# Altium schematic sheet Main.SchDoc
size A4
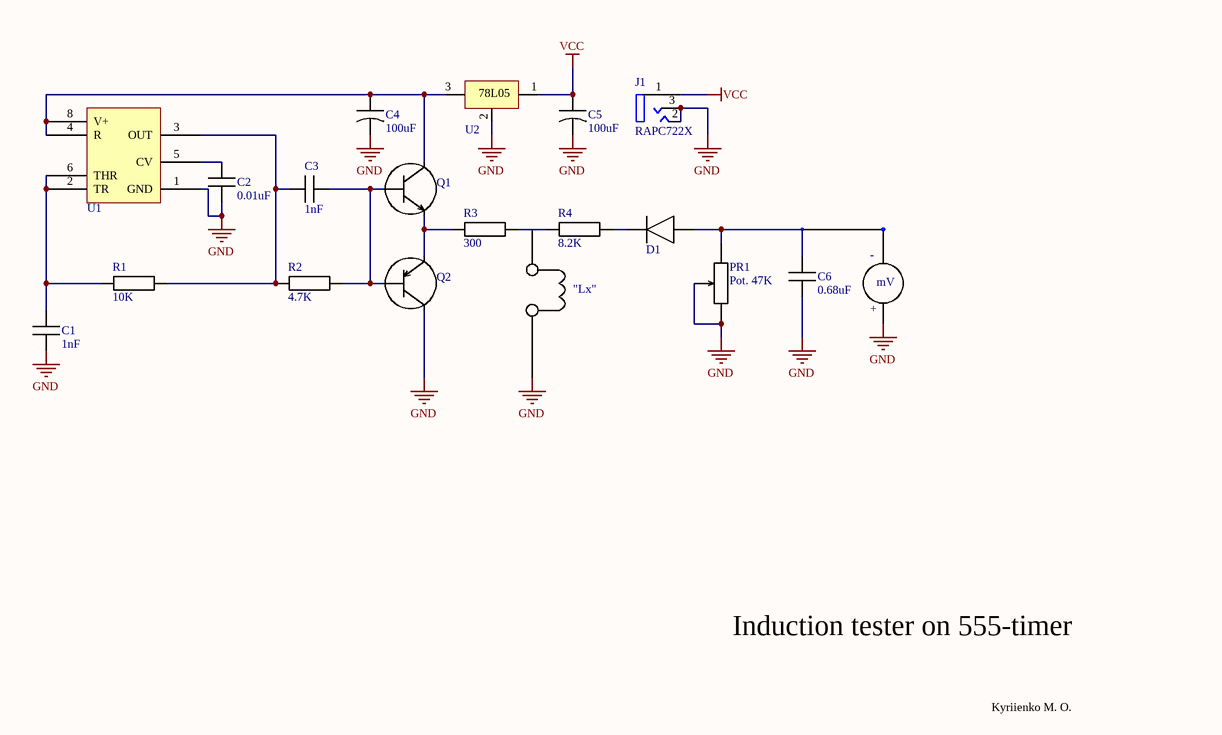
[diagram p0: Main.SchDoc]

## Parts
C1  1nF  [Ceramica]
C2  0.01uF  [Ceramica]
C3  1nF  [Ceramica]
C4  100uF  [Electrolytic]
C5  100uF  [Electrolytic]
C6  0.68uF  [Ceramica]
D1  Diode  [Diode]  (value not drawn)
J1  Part Number: RAPC722X  [Switchcraft_RAPC722X_0]  (hidden comment: Conn_Switchcraft_RAPC722X_eec)
PR1  Pot. 47K  [Portentiometr]
Q1  npn  [TO-92]  (value not drawn)
Q2  pnp  [TO-92]  (value not drawn)
R1  10K  [RESISTOR]
R2  4.7K  [RESISTOR]
R3  300  [RESISTOR]
R4  8.2K  [RESISTOR]
U1  timer 555  [DIP8]  (value not drawn)
U2  78L05  [TO-92]  (value not drawn)

## Nets
GND: C1.2 C2.2 C4.2 C5.2 C6.2 J1.2(DETECT) J1.3(CENTER_TIP) PR1.2(OUT) PR1.3(GND) Q2.3(C) U1.1(GND) U2.2(GND)
VCC: C5.1 J1.1(SLEEVE) U2.1(OUT)
NetC1_1: C1.1 R1.2 U1.2(TR) U1.6(THR)
NetC2_1: C2.1 U1.5(CV)
NetC3_1: C3.1 Q1.2(B) Q2.2(B) R2.1
NetC3_2: C3.2 R1.1 R2.2 U1.3(OUT)
NetC4_1: C4.1 Q1.3(C) U1.4(R) U1.8(V+) U2.3(IN)
NetC6_1: C6.1 D1.1(Anode) PR1.1(IN)
NetD1_2: D1.2(Kathode) R4.1
NetQ1_1: Q1.1(E) Q2.1(E) R3.2
NetR3_1: R3.1 R4.2

## Notes on the sheet
- "Lx"
- -
- mV
- +
- Induction tester on 555-timer
- Kyriienko M. O.
- Labels drawn without touching a wire or pin: GND

## Library data of the parts
C1 C3 = C322C102KFR5TA: CAP CER 1000PF 1.5KV X7R RADIAL; Manufacturer: KEMET; Tolerance: 10%; Dissipation Factor: 2.5%; Lead/Base Style: Formed Leads; Lead Diameter: 0.51mm; Pitch: 5.08mm; Lead Length: 7mm; Supplier 1: Digi-Key; Manufacturer Part Number: C322C102KFR5TA; RoHS: Yes; Category: Ceramic Capacitors; Stock 1: 4516; Pricing 1: 1=1,43000, 10=1,13200, 50=0,98160, 100=0,84940, 500=0,64176, 1000=0,56625, 2500=0,52850, 5000=0,50962 (USD); Mount: Through Hole; Case/Package: Radial; Min Operating Temperature: -55°C; Max Operating Temperature: 125°C; Capacitance: 1nF; Dielectric: X7R; Termination: Radial; Voltage Rating (DC): 1.5kV; Packaging: Bulk; Package Quantity: 500; Voltage Rating: 1.5kV; Series: Golden Max™; Construction: RADIAL; Length: 5.08mm; Width: 5.08mm; Height: 3.18mm; Lead Pitch: 5.08mm; Height - Seated (Max): 0.26inch; Depth: 5.08mm; Radiation Hardening: No; RoHS Compliant: Yes; REACH SVHC: No SVHC; Lead Free: Lead Free; ComponentLink1URL: https://datasheet.ciiva.com/160/f3101-goldmax-160936.pdf?src-supplier=Digi-Key; ComponentLink1Description: https://datasheet.ciiva.com/160/f3101-goldmax-160936.pdf?src-supplier=Digi-Key; Supplier Part Number 1: 399-5099-ND
C2 = K103K15X7RH53L2: Cap Ceramic 0.01uF 100V X7R 10% Radial 2.5mm 125C Bulk; Manufacturer: Vishay BCcomponents; Capacitance: 10nF; Lead/Base Style: Straight; Lead Diameter: 0.5mm; Lead Length: 30mm; Supplier 1: Digi-Key; Manufacturer Part Number: K103K15X7RH53L2; RoHS: Yes; Category: Ceramic Capacitors; Stock 1: 17755; Pricing 1: 1=0,28000, 10=0,19300, 50=0,12840, 100=0,10920, 500=0,07708, 1000=0,06745, 2500=0,06424, 5000=0,05942 (USD); Mount: Through Hole; Case/Package: Dipped; Weight: 0.005644oz; Min Operating Temperature: -55°C; Max Operating Temperature: 125°C; Tolerance: 10%; Packaging: Bulk; Voltage Rating (DC): 100V; Package Quantity: 5000; Voltage Rating: 100V; Dielectric: X7R; Termination: Radial; Series: Mono-Kap™ K; Construction: RADIAL; Diameter: 500um; Length: 4mm; Width: 2.5mm; Height: 4mm; Lead Pitch: 2.5mm; Height - Seated (Max): 0.062inch; Depth: 2.6mm; Thickness: 2.6mm; Radiation Hardening: No; REACH SVHC: Unknown; Lead Free: Lead Free; RoHS Compliant: Yes; ComponentLink1URL: https://datasheet.ciiva.com/5390/mkseries-205465-5390133.pdf?src-supplier=Mouser; ComponentLink1Description: https://datasheet.ciiva.com/5390/mkseries-205465-5390133.pdf?src-supplier=Mouser; ComponentLink2URL: https://datasheet.ciiva.com/7657/526146-7657413.pdf?src-supplier=Element14; ComponentLink2Description: https://datasheet.ciiva.com/7657/526146-7657413.pdf?src-supplier=Element14; ComponentLink3URL: https://datasheet.ciiva.com/16458/kseries-16458794.pdf?src-supplier=Future+Electronics; ComponentLink3Description: https://datasheet.ciiva.com/16458/kseries-16458794.pdf?src-supplier=Future+Electronics; ComponentLink4URL: https://datasheet.ciiva.com/181/49363-vmn-pt9161-181198.pdf?src-supplier=Digi-Key; ComponentLink4Description: https://datasheet.ciiva.com/181/49363-vmn-pt9161-181198.pdf?src-supplier=Digi-Key; Supplier Part Number 1: BC5135-ND
C4 C5 = UPJ1C101MED1TD: Cap Aluminum Lytic 100uF 16V 20% (6.3 X 11mm) Radial 2.5mm 175mA 2000h 105C Ammo Pack; Manufacturer: Nichicon; Impedance: 550mR; Life (Hours): 2000Hour; Lead Diameter: 0.5mm; Supplier 1: Digi-Key; Manufacturer Part Number: UPJ1C101MED1TD; RoHS: Yes; Category: Aluminum Electrolytic Capacitors; Stock 1: 5068; Pricing 1: 1=0,38000, 10=0,26300, 50=0,18440, 100=0,15800, 500=0,11850, 1000=0,10007 (USD); Mount: Through Hole; Case/Package: Radial; Min Operating Temperature: -55°C; Max Operating Temperature: 105°C; Packaging: Tape and Reel; Package Quantity: 2000; Capacitance: 100uF; Voltage Rating: 16V; Tolerance: 20%; Ripple Current: 175mA; Termination: Radial; Voltage Rating (DC): 16V; Series: PJ; Diameter: 10mm; Length: 16mm; Lead Pitch: 0.098inch; Height - Seated (Max): 0.472inch; RoHS Compliant: Yes; ComponentLink1URL: https://datasheet.ciiva.com/6298/e-pj-6298311.pdf?src-supplier=Digi-Key; ComponentLink1Description: https://datasheet.ciiva.com/6298/e-pj-6298311.pdf?src-supplier=Digi-Key; Supplier Part Number 1: 493-5010-1-ND
C6 = FA24X7R1H684KRU00: Capacitor Ceramic 0.68uF 50V X7R 10% 5mm Bulk; Manufacturer: TDK; Supplier 1: Digi-Key; Manufacturer Part Number: FA24X7R1H684KRU00; RoHS: Yes; Category: Ceramic Capacitors; Stock 1: 1988; Pricing 1: 1=0,58000, 10=0,40800, 50=0,30860, 100=0,26880, 500=0,19910, 1000=0,16924, 2500=0,15928, 5000=0,14932 (USD); RoHS Compliant: Yes; Supplier Part Number 1: 445-181142-ND
D1 = 1N4148: Diode Ultra Fast Recovery Rectifier 100 Volt 0.3A 2-Pin DO-3; Manufacturer: ON Semiconductor / Fairchild; Reverse Recovery Time: 4ns; Max Repetitive Reverse Voltage (Vrrm): 100V; Forward Voltage: 1V; Element Configuration: Single; Forward Current: 300mA; Average Rectified Current: 200mA; Peak Non-Repetitive Surge Current: 4A; Max Reverse Current: 5uA; Power Dissipation: 500mW; Max Forward Surge Current (Ifsm): 1A; Polarity: Standard; Capacitance: 4pF; Outside Diameter: 1.85mm; Supplier 1: Digi-Key; Manufacturer Part Number: 1N4148; RoHS: Yes; Category: Integrated Circuits (ICs); Stock 1: 430087; Pricing 1: 1=0,10000, 10=0,07100, 100=0,03870, 500=0,02378, 1000=0,01622, 2000=0,01379, 5000=0,01243, 10000=0,01081, 50000=0,00893 (USD); Mount: Through Hole; Case/Package: DO-35; Number of Pins: 2; Weight: 0.01lb; Contact Plating: Tin,Matte; Min Operating Temperature: -65°C; Max Operating Temperature: 175°C; Packaging: Bulk; Package Quantity: 2000; Max Reverse Voltage (DC): 100V; Recovery Time: 4ns; Series: -; Max Surge Current: 4A; Current Rating: 200mA; Voltage Rating (DC): 100V; Max Power Dissipation: 500mW; Output Current: 200mA; Voltage: 100V; Current: 4A; Reverse Voltage: 100V; Diameter: 1.91mm; Length: 4.56mm; Width: 1.91mm; Height: 4.56mm; Radiation Hardening: No; Lead Free: Lead Free; REACH SVHC: No SVHC; ComponentLink1URL: https://datasheet.ciiva.com/27049/743285-27049708.pdf?src-supplier=Jameco; ComponentLink1Description: https://datasheet.ciiva.com/27049/743285-27049708.pdf?src-supplier=Jameco; ComponentLink2URL: https://datasheet.ciiva.com/1242/1716967-1242233.pdf?src-supplier=Newark; ComponentLink2Description: https://datasheet.ciiva.com/1242/1716967-1242233.pdf?src-supplier=Newark; ComponentLink3URL: https://datasheet.ciiva.com/910/1n914-910546.pdf?src-supplier=Digi-Key; ComponentLink3Description: https://datasheet.ciiva.com/910/1n914-910546.pdf?src-supplier=Digi-Key; ComponentLink4URL: https://datasheet.ciiva.com/3304/fdll914b-3304217.pdf?src-supplier=Avnet; ComponentLink4Description: https://datasheet.ciiva.com/3304/fdll914b-3304217.pdf?src-supplier=Avnet; ComponentLink5URL: https://datasheet.ciiva.com/25951/fdll914b-25951516.pdf?src-supplier=Avnet+Europe; ComponentLink5Description: https://datasheet.ciiva.com/25951/fdll914b-25951516.pdf?src-supplier=Avnet+Europe; Supplier Part Number 1: 1N4148FS-ND
J1 = Conn_Switchcraft_RAPC722X_eec: CONN PWR JACK 2X5.5MM SOLDER; Category Bda670Ac885E6661: Uncategorized; mounting_angle: 90 °; number_of_contacts: 2; voltage_rating_ac: 250 V; Category 0836C53C3D42D3F1: Connectors; Category 001Fcd153521Dbd8: Jack Plugs/Sockets; Category 75Fab8F04590Ae3D: Connectors and Adapters; gender: Female; current_rating: 5 A; Num Pins: 3; helpURL: https://upverter.com/upn/revision/3390e98938df1595/; ComponentLink2Description: Datasheet; Temperature: to; Package: cCONN_PTH_DC_JACK_14MM5_9MM0; Supplier 2: Mouser; Price: 0.740243901321; Supplier 1: Digi-Key; ComponentLink1URL: https://upverter.com/upn/revision/3390e98938df1595/; Supplier Part Number 2: 502-RAPC722X; Supplier Part Number 1: SC1313-ND; Manufacturer: Switchcraft; ComponentLink1Description: Upverter; ComponentLink2URL: https://upverter.com/datasheet/96e949921d5d9c87f4f03f75a44e5e613c467149.pdf; RoHS: TRUE; Mouser Part Number: 502-RAPC722X; color: Black; Digikey Description: CONN PWR JACK 2X5.5MM SOLDER; Digikey Part Number: SC1313-ND; Category A3C16Ecb93907806: Uncategorized; Lead Free: yes; Mounting Type: through hole; Octopart Part Number: da391331d91005fe
PR1 = 23ESA473KMF16N: Potentiometers 23E 47KA 10% 6.35X16FL B8; Manufacturer: TE Connectivity; Power Rating: 400mW; Resistance: 47kR; Voltage Rating: 500V; Number of Turns: 1; Sealable: No (Without); Supplier 1: Newark; Manufacturer Part Number: 23ESA473KMF16N; RoHS: Yes; Category: Variable Resistors and Potentiometers; Stock 1: 3; Pricing 1: 1=0,80700, 10=0,80700, 25=0,80700, 50=0,80700, 100=0,80700, 250=0,80700 (USD); Mount: Panel; Min Operating Temperature: -25°C; Max Operating Temperature: 70°C; Tolerance: 10%; Resistor Type: Carbon; Packaging: Bulk; Package Quantity: 200; Termination: Eyelet; Type: Potentiometer; Series: 23, Citec; Max Power Dissipation: 400mW; Taper: Linear; Number of Gangs: 1; Voltage Rating (DC): 500V; Resistance Tolerance: 10%; Length: 26.7mm; RoHS Compliant: Yes; REACH SVHC: No SVHC; ELV: Compliant; ComponentLink1URL: https://datasheet.ciiva.com/12918/ng-ds-1773115-e-199807-12918317.pdf?src-supplier=Mouser; ComponentLink1Description: https://datasheet.ciiva.com/12918/ng-ds-1773115-e-199807-12918317.pdf?src-supplier=Mouser; ComponentLink2URL: https://datasheet.ciiva.com/22658/1468316-22658904.pdf?src-supplier=Element14; ComponentLink2Description: https://datasheet.ciiva.com/22658/1468316-22658904.pdf?src-supplier=Element14; Supplier Part Number 1: 95W9495
Q1 = BC547B: ON SEMICONDUCTOR - BC547B - Bipolar (BJT) Single Transistor, General Purpose, NPN, 45 V, 300 MHz, 500 mW, 100 mA, 110 hFE; Manufacturer: ON Semiconductor / Fairchild; Collector Emitter Voltage (VCEO): 45V; Collector Base Voltage (VCBO): 50V; Max Power Dissipation: 500mW; Emitter Base Voltage (VEBO): 6V; Max Collector Current: 100mA; Number of Elements: 1; Frequency: 300MHz; hFE Min: 200; Gain Bandwidth Product: 100MHz; Collector Emitter Saturation Voltage: 300mV; Voltage: 40V; Supplier 1: Newark; Manufacturer Part Number: BC547B; RoHS: Yes; Category: BJTs; Stock 1: 1781; Pricing 1: 1=0,43300, 10=0,30500, 100=0,15600, 500=0,12700, 1000=0,09600, 2500=0,08100 (USD); Mount: Through Hole; Case/Package: TO-92; Number of Pins: 3; Contact Plating: Copper,Tin,Silver; Weight: 0.007055oz; Min Operating Temperature: -65°C; Max Operating Temperature: 150°C; Packaging: Bulk; Polarity: NPN; Power Dissipation: 500mW; Package Quantity: 2000; Collector Emitter Breakdown Voltage: 45V; Element Configuration: Single; Transition Frequency: 300MHz; Voltage Rating (DC): 45V; Current Rating: 100mA; Max Frequency: 300MHz; Max Breakdown Voltage: 45V; Length: 4.58mm; Width: 3.86mm; Height: 4.58mm; Radiation Hardening: No; Lead Free: Lead Free; REACH SVHC: No SVHC; ComponentLink1URL: https://datasheet.ciiva.com/17011/bc547-17011404.pdf?src-supplier=Future+Electronics; ComponentLink1Description: https://datasheet.ciiva.com/17011/bc547-17011404.pdf?src-supplier=Future+Electronics; ComponentLink2URL: https://datasheet.ciiva.com/985/bc546-547-548rev5-985523.pdf?src-supplier=Digi-Key; ComponentLink2Description: https://datasheet.ciiva.com/985/bc546-547-548rev5-985523.pdf?src-supplier=Digi-Key; ComponentLink3URL: https://datasheet.ciiva.com/972/bc546-972262.pdf?src-supplier=Digi-Key; ComponentLink3Description: https://datasheet.ciiva.com/972/bc546-972262.pdf?src-supplier=Digi-Key; ComponentLink4URL: https://datasheet.ciiva.com/1195/1868820-1195464.pdf?src-supplier=Element14; ComponentLink4Description: https://datasheet.ciiva.com/1195/1868820-1195464.pdf?src-supplier=Element14; ComponentLink5URL: https://datasheet.ciiva.com/25996/bc550-25996616.pdf?src-supplier=Avnet+Europe; ComponentLink5Description: https://datasheet.ciiva.com/25996/bc550-25996616.pdf?src-supplier=Avnet+Europe; ComponentLink6URL: https://datasheet.ciiva.com/11197/bc550-11197769.pdf?src-supplier=Avnet; ComponentLink6Description: https://datasheet.ciiva.com/11197/bc550-11197769.pdf?src-supplier=Avnet; ComponentLink7URL: https://datasheet.ciiva.com/16472/bc550-16472201.pdf?src-supplier=Avnet+Asia; ComponentLink7Description: https://datasheet.ciiva.com/16472/bc550-16472201.pdf?src-supplier=Avnet+Asia; Supplier Part Number 1: 67K3328
Q2 = KSA539YTA: TRANS PNP 45V 0.2A TO-92; Manufacturer: ON Semiconductor / Fairchild; Max Collector Current: 200mA; Collector Base Voltage (VCBO): -60V; Emitter Base Voltage (VEBO): -5V; Max Power Dissipation: 400mW; hFE Min: 40; Element Configuration: Single; Number of Elements: 1; Collector Emitter Saturation Voltage: -250mV; Current Rating: -200mA; Voltage Rating (DC): -45V; Supplier 1: Mouser; Manufacturer Part Number: KSA539YTA; RoHS: Yes; Category: BJTs; Mount: Through Hole; Case/Package: TO-92-3; Number of Pins: 3; Weight: 0.1782g; Min Operating Temperature: -55°C; Max Operating Temperature: 150°C; Polarity: PNP; Collector Emitter Voltage (VCEO): 45V; Packaging: Ammo Pack; Power Dissipation: 400mW; Package Quantity: 2000; Collector Emitter Breakdown Voltage: 45V; Radiation Hardening: No; Lead Free: Lead Free; ComponentLink1URL: https://datasheet.ciiva.com/4724/ksa539-88760-4724359.pdf?src-supplier=Mouser; ComponentLink1Description: https://datasheet.ciiva.com/4724/ksa539-88760-4724359.pdf?src-supplier=Mouser; ComponentLink2URL: https://datasheet.ciiva.com/982/ksa539-982951.pdf?src-supplier=Digi-Key; ComponentLink2Description: https://datasheet.ciiva.com/982/ksa539-982951.pdf?src-supplier=Digi-Key; Supplier Part Number 1: 512-KSA539YTA
R1 = CFR100J10K: Carbon Film Resistors - Through Hole 10KOhm 1W 500PPM; Manufacturer: TE Connectivity; Tolerance: 5%; Resistance: 10kR; Temperature Coefficient: 0ppm/°C; Voltage Rating: 500V; Number of Resistors: 1; Supplier 1: Digi-Key; Manufacturer Part Number: CFR100J10K; RoHS: Yes; Category: Through-Hole Resistors; Stock 1: 792; Pricing 1: 1=0,29000, 10=0,24100, 25=0,17560, 50=0,12740, 100=0,09440, 250=0,07244, 500=0,05708 (USD); Mount: Axial; Case/Package: Axial; Min Operating Temperature: -55°C; Max Operating Temperature: 155°C; Power Rating: 1W; Resistor Type: Thin Film; Termination: Axial; Packaging: Cut Tape; Number of Terminations: 2; Series: CFR100, Neohm; Max Power Dissipation: 1W; Voltage Rating (DC): 500V; Technology: CARBON FILM; Resistance Tolerance: 5%; Diameter: 5mm; Length: 12mm; RoHS Compliant: Yes; REACH SVHC: No SVHC; ELV: Compliant; ComponentLink1URL: https://datasheet.ciiva.com/11826/0900766b80098b49-11826112.pdf?src-supplier=RSComponents; ComponentLink1Description: https://datasheet.ciiva.com/11826/0900766b80098b49-11826112.pdf?src-supplier=RSComponents; ComponentLink2URL: https://datasheet.ciiva.com/24355/eng-ds-1773195-d-24355942.pdf?src-supplier=Onlinecomponents.com; ComponentLink2Description: https://datasheet.ciiva.com/24355/eng-ds-1773195-d-24355942.pdf?src-supplier=Onlinecomponents.com; ComponentLink3URL: https://datasheet.ciiva.com/16760/70063023-16760748.pdf?src-supplier=Allied+Electronics; ComponentLink3Description: https://datasheet.ciiva.com/16760/70063023-16760748.pdf?src-supplier=Allied+Electronics; ComponentLink4URL: https://datasheet.ciiva.com/22664/1723854-22664894.pdf?src-supplier=Element14; ComponentLink4Description: https://datasheet.ciiva.com/22664/1723854-22664894.pdf?src-supplier=Element14; Supplier Part Number 1: A105978CT-ND
R2 = CFS1/4CT52R472J: Res Carbon Film 4.7K Ohm 5% 0.25W(1/4W) -450ppm/C to 350ppm/C Conformal Coated AXL T/R; Manufacturer: KOA Speer; Resistance: 4.7kR; Power Rating: 250mW; Voltage Rating: 250V; Temperature Coefficient: 350ppm/°C; Supplier 1: Digi-Key; Manufacturer Part Number: CFS1/4CT52R472J; RoHS: Yes; Category: Through-Hole Resistors; Stock 1: 3871; Pricing 1: 1=0,10000, 10=0,04600, 25=0,03360, 50=0,02560, 100=0,01890, 250=0,01440, 500=0,01152, 1000=0,00848 (USD); Mount: Through Hole; Case/Package: Conformal; Min Operating Temperature: -55°C; Max Operating Temperature: 155°C; Tolerance: 5%; Packaging: Tape and Reel; Package Quantity: 5000; Resistor Type: Carbon Film; Termination: Axial; Series: CF; Construction: Cylindrical; Length: 3.2mm; Military Standard: Not; ComponentLink1URL: https://datasheet.ciiva.com/5478/cf-5478494.pdf?src-supplier=Mouser; ComponentLink1Description: https://datasheet.ciiva.com/5478/cf-5478494.pdf?src-supplier=Mouser; Supplier Part Number 1: 2019-CFS1/4CT52R472JCT-ND
R3 = RSF100JB-73-300R: RES 300 OHM 1W 5% AXIAL; Manufacturer: Yageo; Resistance: 300R; Supplier 1: Digi-Key; Manufacturer Part Number: RSF100JB-73-300R; RoHS: Yes; Category: Through-Hole Resistors; Stock 1: 1681; Pricing 1: 1=0,31000, 10=0,26500, 25=0,19240, 50=0,13940, 100=0,10340, 250=0,07936, 500=0,06252, 1000=0,04329, 5000=0,03608 (USD); Case/Package: Axial; Min Operating Temperature: -55°C; Max Operating Temperature: 235°C; Max Power Dissipation: 1W; Resistor Type: Metal Oxide; Number of Terminations: 2; Features: Flame Retardant Coating; Package Quantity: 100; Tolerance: 5%; Packaging: Bulk; Length: 0.453inch; ComponentLink1URL: https://datasheet.ciiva.com/2714/yageolr-rsf-2013-2714971.pdf?src-supplier=Digi-Key; ComponentLink1Description: https://datasheet.ciiva.com/2714/yageolr-rsf-2013-2714971.pdf?src-supplier=Digi-Key; Supplier Part Number 1: 300W-1-ND
R4 = CF14JA8K20: RES 8.2K OHM 1/4W 5% AXIAL; Manufacturer: Stackpole Electronics; Resistance: 8.2kR; Temperature Coefficient: -400ppm/°C; Max Power Dissipation: 250mW; Supplier 1: Avnet; Manufacturer Part Number: CF14JA8K20; RoHS: Yes; Category: Through-Hole Resistors; Pricing 1: 5000=0,00469, 10000=0,00462, 20000=0,00449, 30000=0,00439, 40000=0,00422, 50000=0,00413, 500000=0,00403 (USD); Mount: Through Hole,Axial; Case/Package: Axial; Contact Plating: Tin,Matte; Min Operating Temperature: -55°C; Max Operating Temperature: 155°C; Package Quantity: 5000; Packaging: Tape and Reel; Tolerance: 5%; Resistor Type: Carbon Film; Number of Terminations: 2; Features: Flame Retardant Coating; Series: CF; Diameter: 2.3mm; Length: 0.256inch; Radiation Hardening: No; RoHS Compliant: Yes; ComponentLink1URL: https://www.seielect.com/Catalog/SEI-CF_CFM.pdf?src-supplier=Digi-Key; ComponentLink1Description: https://www.seielect.com/Catalog/SEI-CF_CFM.pdf?src-supplier=Digi-Key; ComponentLink2URL: https://www.seielect.com/catalog/SEI-CF_CFM.pdf?src-supplier=Avnet; ComponentLink2Description: https://www.seielect.com/catalog/SEI-CF_CFM.pdf?src-supplier=Avnet; Supplier Part Number 1: CF14JA8K20
U1 = NE555P: Standard Timer Single 8-Pin PDIP Tube; Manufacturer: Texas Instruments; Frequency: 500kHz; Quiescent Current: 15mA; Operating Supply Current: 10mA; High Level Output Current: -200mA; Low Level Output Current: 200mA; Min Supply Voltage: 4.5V; Max Supply Voltage: 16V; Nominal Supply Current: 2mA; Number of Timers/Counters: 1; Operating Supply Voltage: 5V; Supplier 1: Mouser; Manufacturer Part Number: NE555P; RoHS: Yes; Category: Clock and Timing; Stock 1: 16580; Pricing 1: 1=0,41000, 10=0,32900, 50=0,32900, 100=0,32900, 1000=0,32900, 10000=0,32900 (USD); Mount: Through Hole; Case/Package: PDIP; Number of Pins: 8; Weight: 0.015535oz; Contact Plating: Gold; Min Operating Temperature: 0°C; Max Operating Temperature: 70°C; Packaging: Rail/Tube; Package Quantity: 50; Current Rating: 10mA; Length: 9.81mm; Width: 6.35mm; Height: 4.57mm; Radiation Hardening: No; Lead Free: Lead Free; RoHS Compliant: Yes; REACH SVHC: No SVHC; ComponentLink1URL: https://datasheet.ciiva.com/1139/sa555-1139904.pdf?src-supplier=Element14; ComponentLink1Description: https://datasheet.ciiva.com/1139/sa555-1139904.pdf?src-supplier=Element14; ComponentLink2URL: https://datasheet.ciiva.com/19457/904085-19457361.pdf?src-supplier=Jameco; ComponentLink2Description: https://datasheet.ciiva.com/19457/904085-19457361.pdf?src-supplier=Jameco; ComponentLink3URL: https://datasheet.ciiva.com/26325/152184-da-01-en-ne555p-timer-tid-26325915.pdf?src-supplier=Conrad; ComponentLink3Description: https://datasheet.ciiva.com/26325/152184-da-01-en-ne555p-timer-tid-26325915.pdf?src-supplier=Conrad; ComponentLink4URL: https://datasheet.ciiva.com/1147/1764032-1147750.pdf?src-supplier=Newark; ComponentLink4Description: https://datasheet.ciiva.com/1147/1764032-1147750.pdf?src-supplier=Newark; ComponentLink5URL: https://datasheet.ciiva.com/14094/ne555-series-eng-tds-14094950.pdf?src-supplier=Distrelec; ComponentLink5Description: https://datasheet.ciiva.com/14094/ne555-series-eng-tds-14094950.pdf?src-supplier=Distrelec; ComponentLink6URL: https://datasheet.ciiva.com/14274/ne555-14274456.pdf?src-supplier=Avnet; ComponentLink6Description: https://datasheet.ciiva.com/14274/ne555-14274456.pdf?src-supplier=Avnet; ComponentLink7URL: https://datasheet.ciiva.com/15152/getdatasheetpartid-248510-15152620.pdf?src-supplier=Verical; ComponentLink7Description: https://datasheet.ciiva.com/15152/getdatasheetpartid-248510-15152620.pdf?src-supplier=Verical; ComponentLink8URL: https://datasheet.ciiva.com/1233/ne555-1233454.pdf?src-supplier=Digi-Key; ComponentLink8Description: https://datasheet.ciiva.com/1233/ne555-1233454.pdf?src-supplier=Digi-Key; ComponentLink9URL: https://datasheet.ciiva.com/26228/ne555-26228892.pdf?src-supplier=Avnet+Europe; ComponentLink9Description: https://datasheet.ciiva.com/26228/ne555-26228892.pdf?src-supplier=Avnet+Europe; Supplier Part Number 1: 595-NE555P
U2 = L78L05ACZ: Standard Regulator Pos 5V 0.1A 3-Pin TO-92 Bag; Manufacturer: STMicroelectronics; Max Input Voltage: 30V; Output Current: 100mA; Number of Outputs: 1; Min Input Voltage: 7V; Polarity: Positive; Output Type: Fixed,Adjustable; Dropout Voltage: 1.7V; Quiescent Current: 6mA; Power Supply Rejection Ratio (PSRR): 49dB; Accuracy: 5%; Output Voltage Accuracy: 4%; Tolerance: 10%; Supplier 1: Digi-Key; Manufacturer Part Number: L78L05ACZ; RoHS: Yes; Category: Voltage Regulators - Linear; Stock 1: 7; Pricing 1: 1=0,50000, 10=0,40900, 25=0,37360, 100=0,27810, 250=0,25208, 500=0,20860, 1000=0,15646, 2500=0,14350 (USD); Mount: Through Hole; Case/Package: TO-92; Number of Pins: 3; Weight: 0.016oz; Contact Plating: Tin,Matte; Min Operating Temperature: 0°C; Max Operating Temperature: 125°C; Output Voltage: 5V; Max Output Current: 100mA; Packaging: Bag; Package Quantity: 2500; Number of Regulators: 1; Nominal Output Voltage: 5V; Series: -; Min Output Voltage: 5V; Output Configuration: Positive; Length: 4.95mm; Width: 3.94mm; Height: 4.95mm; Radiation Hardening: No; Lead Free: Lead Free; RoHS Compliant: Yes; REACH SVHC: No SVHC; ComponentLink1URL: https://datasheet.ciiva.com/15110/getdatasheetpartid-34813-15110912.pdf?src-supplier=Verical; ComponentLink1Description: https://datasheet.ciiva.com/15110/getdatasheetpartid-34813-15110912.pdf?src-supplier=Verical; ComponentLink2URL: https://datasheet.ciiva.com/26347/47-3278e-26347723.pdf?src-supplier=Rapid+Electronics; ComponentLink2Description: https://datasheet.ciiva.com/26347/47-3278e-26347723.pdf?src-supplier=Rapid+Electronics; ComponentLink3URL: https://datasheet.ciiva.com/19480/889428-19480893.pdf?src-supplier=Jameco; ComponentLink3Description: https://datasheet.ciiva.com/19480/889428-19480893.pdf?src-supplier=Jameco; ComponentLink4URL: https://datasheet.ciiva.com/26904/l78l05acz-26904499.pdf?src-supplier=IIIC; ComponentLink4Description: https://datasheet.ciiva.com/26904/l78l05acz-26904499.pdf?src-supplier=IIIC; ComponentLink5URL: https://datasheet.ciiva.com/29156/156059-da-01-en-spannungsregler-l78l05acz-to92-stm-29156936.pdf?src-supplier=Conrad; ComponentLink5Description: https://datasheet.ciiva.com/29156/156059-da-01-en-spannungsregler-l78l05acz-to92-stm-29156936.pdf?src-supplier=Conrad; ComponentLink6URL: https://datasheet.ciiva.com/1511/1868798-1511941.pdf?src-supplier=Element14; ComponentLink6Description: https://datasheet.ciiva.com/1511/1868798-1511941.pdf?src-supplier=Element14; ComponentLink7URL: https://datasheet.ciiva.com/3223/cd00000446-3223430.pdf?src-supplier=Avnet; ComponentLink7Description: https://datasheet.ciiva.com/3223/cd00000446-3223430.pdf?src-supplier=Avnet; ComponentLink8URL: https://datasheet.ciiva.com/29570/cd00000446-29570390.pdf?src-supplier=Digi-Key; ComponentLink8Description: https://datasheet.ciiva.com/29570/cd00000446-29570390.pdf?src-supplier=Digi-Key; ComponentLink9URL: https://datasheet.ciiva.com/4882/cd00000446-355303-4882380.pdf?src-supplier=Mouser; ComponentLink9Description: https://datasheet.ciiva.com/4882/cd00000446-355303-4882380.pdf?src-supplier=Mouser; ComponentLink10URL: https://datasheet.ciiva.com/18404/70013906-18404044.pdf?src-supplier=Allied+Electronics; ComponentLink10Description: https://datasheet.ciiva.com/18404/70013906-18404044.pdf?src-supplier=Allied+Electronics; ComponentLink11URL: https://datasheet.ciiva.com/14111/szl78l-data-en-14111405.pdf?src-supplier=Distrelec; ComponentLink11Description: https://datasheet.ciiva.com/14111/szl78l-data-en-14111405.pdf?src-supplier=Distrelec; Supplier Part Number 1: 497-2952-ND